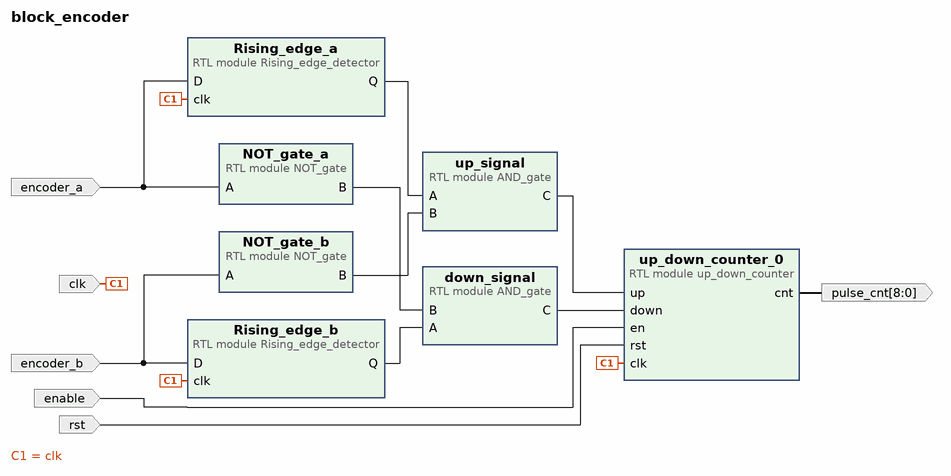
[diagram p0: block diagram of the top level]
# Vivado block design block_encoder, xc7z020clg400-1, Vivado 2023.2
create_bd_design block_encoder

create_bd_port -dir I clk
create_bd_port -dir I rst
create_bd_port -dir I encoder_a
create_bd_port -dir I encoder_b
create_bd_port -dir I enable
create_bd_port -dir O -from 8 -to 0 pulse_cnt

create_bd_cell -type module -reference up_down_counter up_down_counter_0
set_property -dict {CONFIG.max_val_binary {"101101000"} CONFIG.n_bits 9} [get_bd_cells up_down_counter_0]
create_bd_cell -type module -reference NOT_gate NOT_gate_b
create_bd_cell -type module -reference AND_gate up_signal
create_bd_cell -type module -reference NOT_gate NOT_gate_a
create_bd_cell -type module -reference AND_gate down_signal
create_bd_cell -type module -reference Rising_edge_detector Rising_edge_a
create_bd_cell -type module -reference Rising_edge_detector Rising_edge_b

# ---- connections ----

connect_bd_net -net AND_gate_0_C [get_bd_pins up_signal/C] [get_bd_pins up_down_counter_0/up]
connect_bd_net -net AND_gate_1_C [get_bd_pins down_signal/C] [get_bd_pins up_down_counter_0/down]
connect_bd_net -net NOT_gate_0_B [get_bd_pins NOT_gate_a/B] [get_bd_pins down_signal/B]
connect_bd_net [get_bd_pins NOT_gate_b/B] [get_bd_pins up_signal/B]
connect_bd_net [get_bd_pins Rising_edge_a/Q] [get_bd_pins up_signal/A]
connect_bd_net [get_bd_pins Rising_edge_b/Q] [get_bd_pins down_signal/A]
connect_bd_net [get_bd_ports clk] [get_bd_pins up_down_counter_0/clk] [get_bd_pins Rising_edge_b/clk] [get_bd_pins Rising_edge_a/clk]
connect_bd_net [get_bd_ports enable] [get_bd_pins up_down_counter_0/en]
connect_bd_net [get_bd_ports encoder_a] [get_bd_pins NOT_gate_a/A] [get_bd_pins Rising_edge_a/D]
connect_bd_net [get_bd_ports encoder_b] [get_bd_pins NOT_gate_b/A] [get_bd_pins Rising_edge_b/D]
connect_bd_net [get_bd_ports rst] [get_bd_pins up_down_counter_0/rst]
connect_bd_net [get_bd_pins up_down_counter_0/cnt] [get_bd_ports pulse_cnt]

validate_bd_design
save_bd_design
